# Altium schematic sheet Carte_Barriere_Optique_Interface.SchDoc
size A4
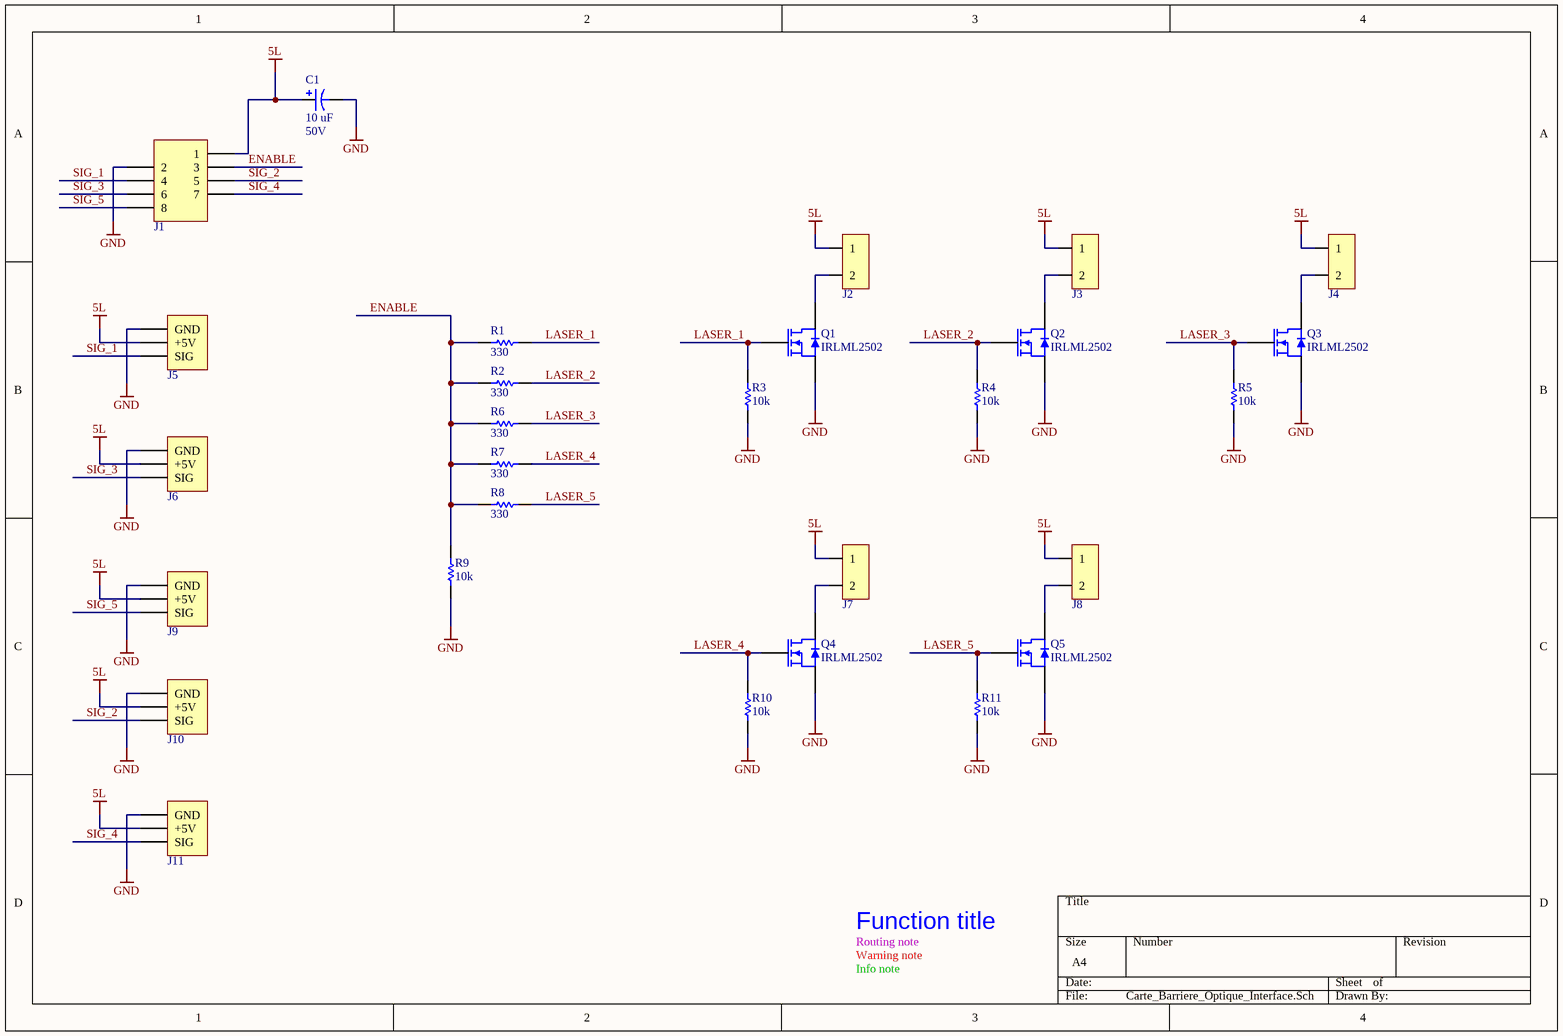
[diagram p0: Carte_Barriere_Optique_Interface.SchDoc]

## Parts
C1  10 uF  RatedVoltage: 50V  [WCAP-ATG8_5x11x2x0.5]
J1  690367280876  [690367280876]  (value not drawn)
J2  22-03-2021  [22-03-2021]  (value not drawn)
J3  22-03-2021  [22-03-2021]  (value not drawn)
J4  22-03-2021  [22-03-2021]  (value not drawn)
J5  61300311021  [61300311021]  (value not drawn)
J6  61300311021  [61300311021]  (value not drawn)
J7  22-03-2021  [22-03-2021]  (value not drawn)
J8  22-03-2021  [22-03-2021]  (value not drawn)
J9  61300311021  [61300311021]  (value not drawn)
J10  61300311021  [61300311021]  (value not drawn)
J11  61300311021  [61300311021]  (value not drawn)
Q1  IRLML2502  [SOT-23]
Q2  IRLML2502  [SOT-23]
Q3  IRLML2502  [SOT-23]
Q4  IRLML2502  [SOT-23]
Q5  IRLML2502  [SOT-23]
R1  value 330  [RESC1608X06N]  (hidden comment: RC0603FR-07330RL)
R2  value 330  [RESC1608X06N]  (hidden comment: RC0603FR-07330RL)
R3  value 10k  [RESC1608X06N]  (hidden comment: RC0603FR-0710KL)
R4  value 10k  [RESC1608X06N]  (hidden comment: RC0603FR-0710KL)
R5  value 10k  [RESC1608X06N]  (hidden comment: RC0603FR-0710KL)
R6  value 330  [RESC1608X06N]  (hidden comment: RC0603FR-07330RL)
R7  value 330  [RESC1608X06N]  (hidden comment: RC0603FR-07330RL)
R8  value 330  [RESC1608X06N]  (hidden comment: RC0603FR-07330RL)
R9  value 10k  [RESC1608X06N]  (hidden comment: RC0603FR-0710KL)
R10  value 10k  [RESC1608X06N]  (hidden comment: RC0603FR-0710KL)
R11  value 10k  [RESC1608X06N]  (hidden comment: RC0603FR-0710KL)

## Nets
5L: C1.1 J1.1 J2.1 J3.1 J4.1 J5.2(+5V) J6.2(+5V) J7.1 J8.1 J9.2(+5V) J10.2(+5V) J11.2(+5V)
GND: C1.2 J1.2 J5.1(GND) J6.1(GND) J9.1(GND) J10.1(GND) J11.1(GND) Q1.2(S) Q2.2(S) Q3.2(S) Q4.2(S) Q5.2(S) R3.1 R4.1 R5.1 R9.1 R10.1 R11.1
ENABLE: J1.3 R1.1 R2.1 R6.1 R7.1 R8.1 R9.2
LASER_1: Q1.1(G) R1.2 R3.2
LASER_2: Q2.1(G) R2.2 R4.2
LASER_3: Q3.1(G) R5.2 R6.2
LASER_4: Q4.1(G) R7.2 R10.2
LASER_5: Q5.1(G) R8.2 R11.2
SIG_1: J1.4 J5.3(SIG)
SIG_2: J1.5 J10.3(SIG)
SIG_3: J1.6 J6.3(SIG)
SIG_4: J1.7 J11.3(SIG)
SIG_5: J1.8 J9.3(SIG)
NetJ2_2: J2.2 Q1.3(D)
NetJ3_2: J3.2 Q2.3(D)
NetJ4_2: J4.2 Q3.3(D)
NetJ7_2: J7.2 Q4.3(D)
NetJ8_2: J8.2 Q5.3(D)

## Notes on the sheet
- Routing note
- Warning note
- Info note
- Function title

## Library data of the parts
C1 = WCAP-ATG8, 860010672009: CAP Alu 10 UF 20% 50 V; Manufacturer: Wurth Elektronik; PublishedDate: July 2016; ComponentLink1Description: Manufacturer; ComponentLink1URL: http://www.we-online.de; ComponentLink2Description: Datasheet; ComponentLink2URL: http://katalog.we-online.de/pbs/datasheet/860010672009.pdf; Manufacturer Part Number: 860010672009; Value: 10 uF; Size: 5mmx11mm
J1 = 690367280876: WR-MM 8p Female SMT Connector with Polarization; Manufacturer: Wurth Electronics Inc.; Value: 8; Manufacturer Part Number: 690367280876; ComponentLink1URL: http://www.we-online.com; ComponentLink1Description: Manufacturer; ComponentLink2URL: http://katalog.we-online.de/em/datasheet/69036728xx76.pdf; ComponentLink2Description: Datasheet; Supplier 1: Farnell; Supplier Part Number 1: 1641850
J2-J4 J7 J8 = 22-03-2021: Manufacturer 1: MOLEX; Supplier 1: Farnell; Supplier Part Number 1: 9731075; Manufacturer Part Number: 22-03-2021; Pricing: 10=0.189, 100=0.147, 200=0.119, 500=0.108, 1000=0.088, 2500=0.08, 2500=0.0711, 20000=0.064 (EUR); ComponentLink1URL: http://www.farnell.com/cad/1533907.pdf; ComponentLink1Description: http://www.farnell.com/cad/1533907.pdf; ComponentLink2URL: http://www.farnell.com/datasheets/1791308.pdf; ComponentLink2Description: http://www.farnell.com/datasheets/1791308.pdf
J5 J6 J9-J11 = 61300311021: CONN HEADER 3p horiz. 2.54mm; Manufacturer: Wurth Electronics Inc.; Value: 3; Supplier 1: Farnell; Supplier Part Number 1: 2356177; Manufacturer Part Number: 61300311021; ComponentLink1URL: http://www.we-online.com; ComponentLink1Description: Manufacturer; ComponentLink2Description: Datasheet; ComponentLink2URL: http://katalog.we-online.de/em/datasheet/6130xx11021.pdf
Q1-Q5 = IRLML2502: MOSFET CANAL N SOT-23; Manufacturer 1: INTERNATIONAL RECTIFIER; Manufacturer Part Number: IRLML2502PBF; ComponentLink1Description: Datasheet; ComponentLink1URL: http://www.farnell.com/datasheets/1912230.pdf; Supplier 1: Farnell; Supplier Part Number 1: 9102981
R1 R2 R6-R8 = RC0603FR-07330RL: RES SMD 330 OHM 1% 1/10W 0603; Manufacturer: Yageo; Power: 100mW; Vmax: 50V; Manufacturer Part Number: RC0603FR-07330RL; Type: Thick Film; ComponentLink1Description: Manufacturer; ComponentLink1URL: http://www.yageo.com/NewPortal/_en/index.jsp; ComponentLink2Description: Datasheet; ComponentLink2URL: http://www.farnell.com/datasheets/2167052.pdf; Supplier 1: Farnell; Supplier Part Number 1: 9238425; Precision: ±1%
R3-R5 R9-R11 = RC0603FR-0710KL: RES SMD 10K OHM 1% 1/10W 0603; Manufacturer: Yageo; Power: 100mW; Vmax: 50V; Manufacturer Part Number: RC0603FR-0710KL; Type: Thick Film; ComponentLink1Description: Manufacturer; ComponentLink1URL: http://www.yageo.com/NewPortal/_en/index.jsp; ComponentLink2Description: Datasheet; ComponentLink2URL: http://www.farnell.com/datasheets/2167052.pdf; Supplier 1: Farnell; Supplier Part Number 1: 9238603; Precision: ±1%